# Altium schematic sheet Glucometer-I.C.- RF Module V2.SchDoc
size Letter
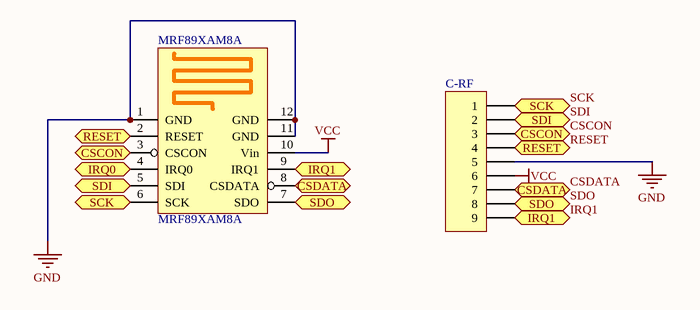
[diagram p0: Glucometer-I.C.- RF Module V2.SchDoc]

## Parts
C-RF  Header 9  [HDR1X9]  (value not drawn)
MRF89XAM8A  MRF89XAM8A  [MRF89XAM8A]

## Ports
CSCON, CSDATA, IRQ0, IRQ1, RESET, SCK, SDI, SDO

## Nets
GND: C-RF.5 MRF89XAM8A.1(GND) MRF89XAM8A.11(GND) MRF89XAM8A.12(GND)
VCC: C-RF.6 MRF89XAM8A.10(Vin)
CSCON: C-RF.3 MRF89XAM8A.3(CSCON) ; port CSCON
CSDATA: C-RF.7 MRF89XAM8A.8(CSDATA) ; port CSDATA
IRQ0: MRF89XAM8A.4(IRQ0) ; port IRQ0
IRQ1: C-RF.9 MRF89XAM8A.9(IRQ1) ; port IRQ1
RESET: C-RF.4 MRF89XAM8A.2(RESET) ; port RESET
SCK: C-RF.1 MRF89XAM8A.6(SCK) ; port SCK
SDI: C-RF.2 MRF89XAM8A.5(SDI) ; port SDI
SDO: C-RF.8 MRF89XAM8A.7(SDO) ; port SDO

## Library data of the parts
C-RF = Header 9: Header, 9-Pin; LatestRevisionDate: 17-Jul-2002; LatestRevisionNote: Re-released for DXP Platform.; Publisher: Altium Limited
MRF89XAM8A = MRF89XAM8A: RF Module. 868MHz Ultra Low Power Sub-Ghz Transceiver Module